# Altium schematic sheet VestaTop.SchDoc
size A4
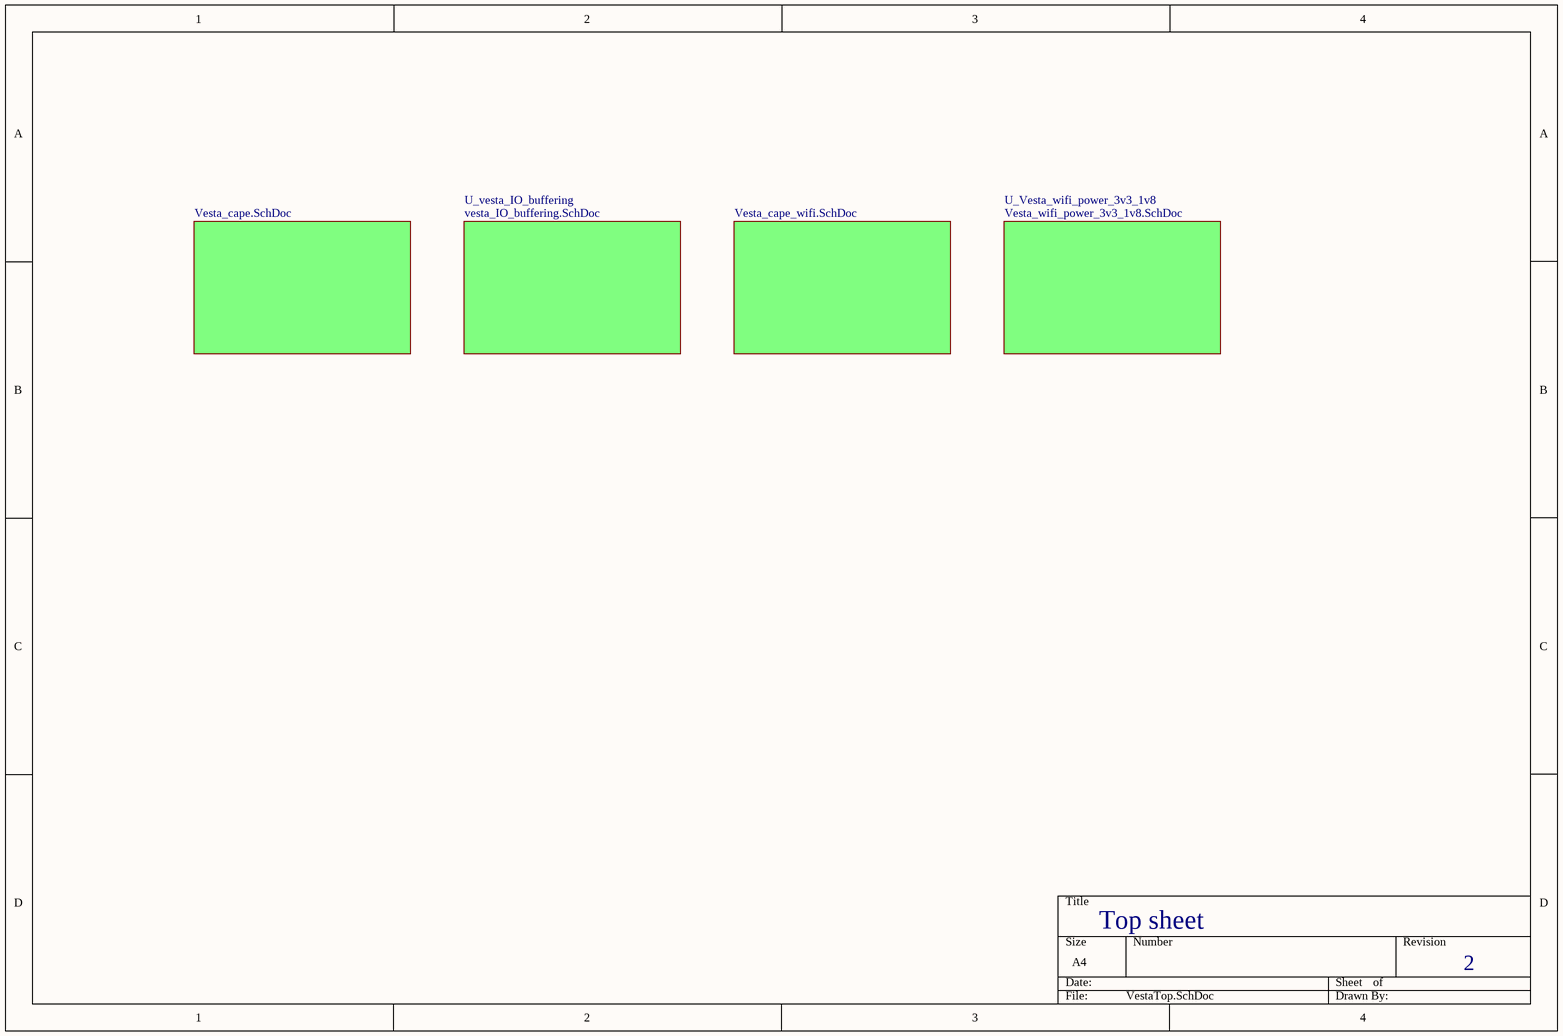
[diagram p0: VestaTop.SchDoc]

## Sub-sheets
U_Vesta_cape = Vesta_cape.SchDoc: no entries
U_Vesta_cape_wifi = Vesta_cape_wifi.SchDoc: no entries
U_vesta_IO_buffering = vesta_IO_buffering.SchDoc: no entries
U_Vesta_wifi_power_3v3_1v8 = Vesta_wifi_power_3v3_1v8.SchDoc: no entries

## Notes on the sheet
- Top sheet
- 2